# Altium schematic sheet TMouse.schDoc: LiveDesign Evaluation - Video Windows
size A3; Organization: Altium Limited; Address1: L3, 12a Rodborough Rd; Address2: Frenchs Forest; Address3: NSW; Address4: Australia 2086; DocumentNumber: 10; SheetNumber: 10; SheetTotal: 20
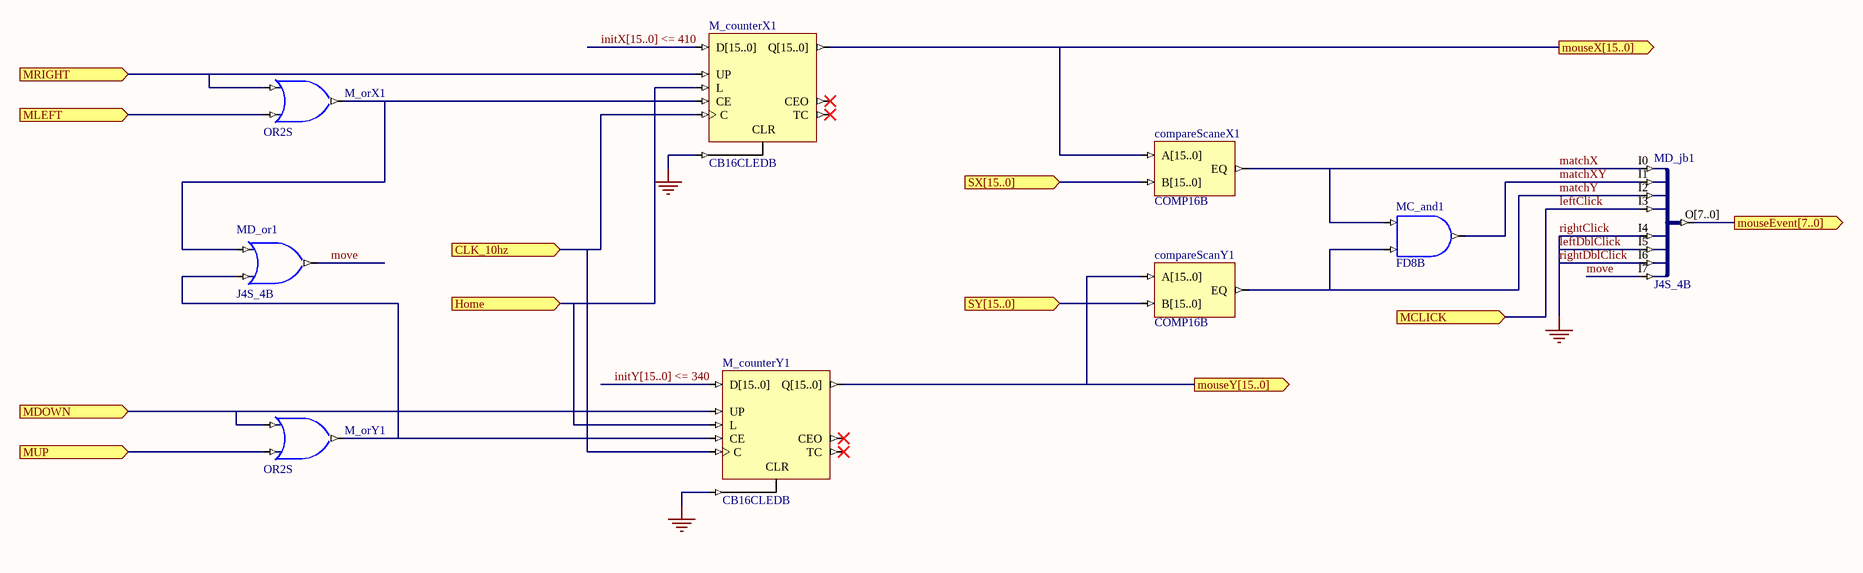
[diagram p0: TMouse.schDoc]

## Parts
compareScaneX1  COMP16B
compareScanY1  COMP16B
M_counterX1  CB16CLEDB
M_counterY1  CB16CLEDB
M_orX1  OR2S
M_orY1  OR2S
MC_and1  FD8B
MD_jb1  J4S_4B
MD_or1  J4S_4B

## Ports
CLK_10hz (in), Home (in), MCLICK (in), MDOWN (in), MLEFT (in), mouseEvent[7..0] (out), mouseX[15..0] (out), mouseY[15..0] (out), MRIGHT (in), MUP (in), SX[15..0] (in), SY[15..0] (in)

## Nets
leftDblClick: M_counterX1.CLR M_counterY1.CLR MD_jb1.I4 MD_jb1.I5 MD_jb1.I6  [also labelled GND, rightClick, rightDblClick]
CLK_10hz: M_counterX1.C M_counterY1.C ; port CLK_10hz
Home: M_counterX1.L M_counterY1.L ; port Home
initX[15..0] <= 410: M_counterX1.D[15..0]
initY[15..0] <= 340: M_counterY1.D[15..0]
leftClick: MD_jb1.I3 ; port MCLICK
matchX: compareScaneX1.EQ MC_and1.I0 MD_jb1.I0
matchXY: MC_and1.O MD_jb1.I1
matchY: compareScanY1.EQ MC_and1.I1 MD_jb1.I2
MDOWN: M_counterY1.UP M_orY1.I0 ; port MDOWN
MLEFT: M_orX1.I1 ; port MLEFT
mouseEvent[7..0]: MD_jb1.O[7..0] ; port mouseEvent[7..0]
mouseX[15..0]: compareScaneX1.A[15..0] M_counterX1.Q[15..0] ; port mouseX[15..0]
mouseY[15..0]: compareScanY1.A[15..0] M_counterY1.Q[15..0] ; port mouseY[15..0]
move: MD_jb1.I7 MD_or1.O
MRIGHT: M_counterX1.UP M_orX1.I0 ; port MRIGHT
MUP: M_orY1.I1 ; port MUP
SX[15..0]: compareScaneX1.B[15..0] ; port SX[15..0]
SY[15..0]: compareScanY1.B[15..0] ; port SY[15..0]
NetM_counterX1_CE: M_counterX1.CE M_orX1.O MD_or1.I0
NetM_counterY1_CE: M_counterY1.CE M_orY1.O MD_or1.I1

Not connected (* = marked no-connect by the designer): M_counterX1 CEO* TC*; M_counterY1 CEO* TC*

## Buses and harness runs
bus initX[15..0] <= 410
bus initY[15..0] <= 340

## Notes on the sheet
- Title
- Size:
- Date:
- A3
- Number:
- Time:
- Revision:
- Sheet
- of
- File:

## Library data of the parts
compareScaneX1 compareScanY1 = COMP16B: 16-Bit Identity Comparator, Bus Version; Xilinx Equivalent: COMP16; ArchiveName: GENERIC; Published: 9-30-2003; Publisher: Altium Limited; Core Revision: 1.00.00
M_counterX1 M_counterY1 = CB16CLEDB: 16-Bit Loadable Cascadable Bidirectional Binary Counter with Clock Enable and Asynchronous Clear, Bus Version; ArchiveName: GENERIC; Published: 9-30-2003; Publisher: Altium Limited; Xilinx Equivalent: CB16CLED; Core Revision: 1.00.00
M_orX1 M_orY1 MD_or1 = OR2S: 2-Input OR Gate, Single Pin Version; Xilinx Equivalent: OR2; ArchiveName: GENERIC; Published: 9-30-2003; Publisher: Altium Limited; Core Revision: 1.00.00
MC_and1 = AND2S: 2-Input AND Gate, Single Pin Version; Xilinx Equivalent: AND2; ArchiveName: GENERIC; Published: 9-30-2003; Publisher: Altium Limited; Core Revision: 1.00.00
MD_jb1 = J8S_8B: 8 Single pin inputs to single 8-Bit output bus; ArchiveName: GENERIC; Published: 9-30-2003; Publisher: Altium Limited; Core Revision: 1.00.00